# Altium schematic sheet 41-SoC POWER SUPPLY.SchDoc
size 513 x 386 mm
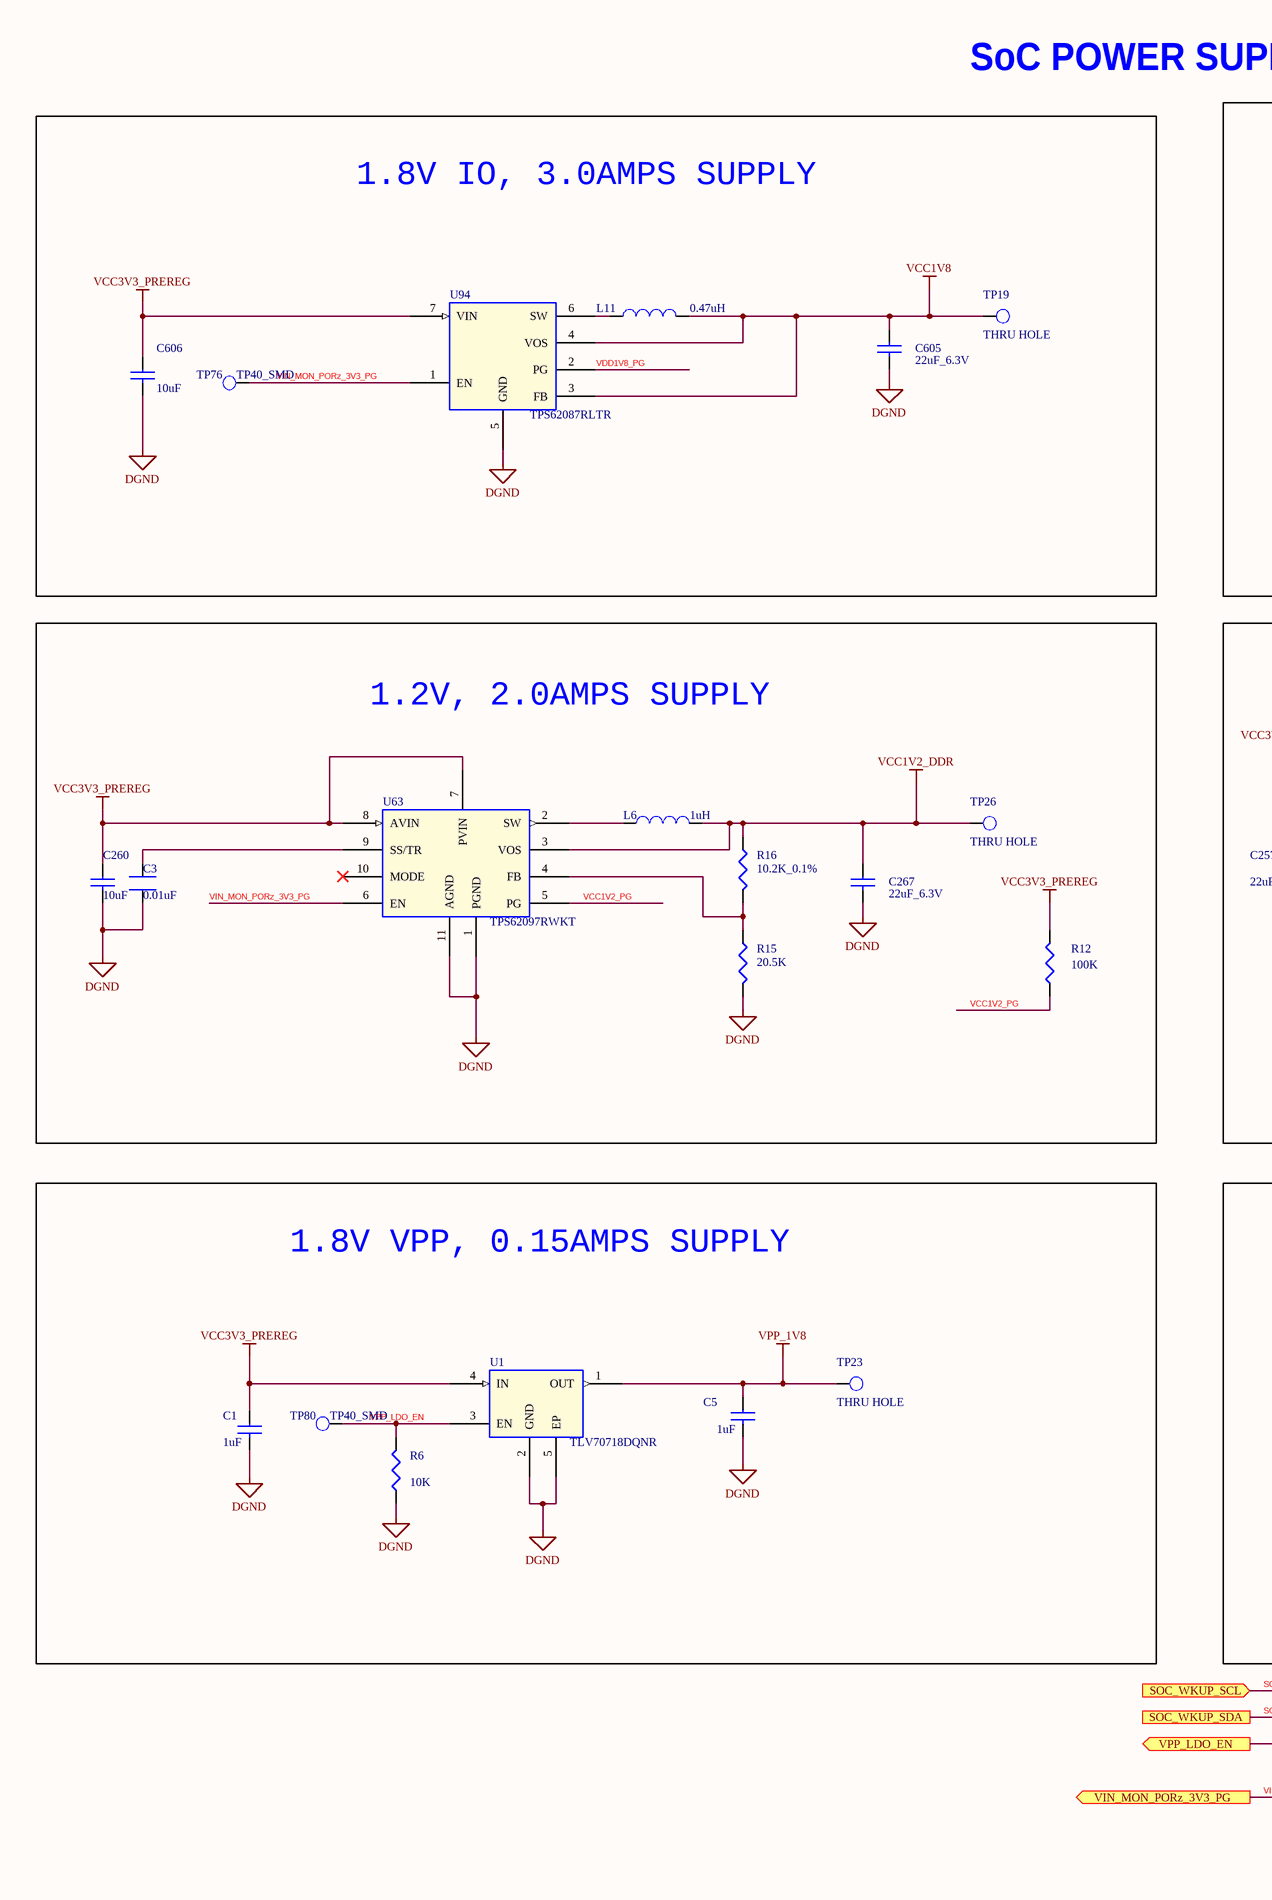
[diagram p0: 41-SoC POWER SUPPLY.SchDoc, left]
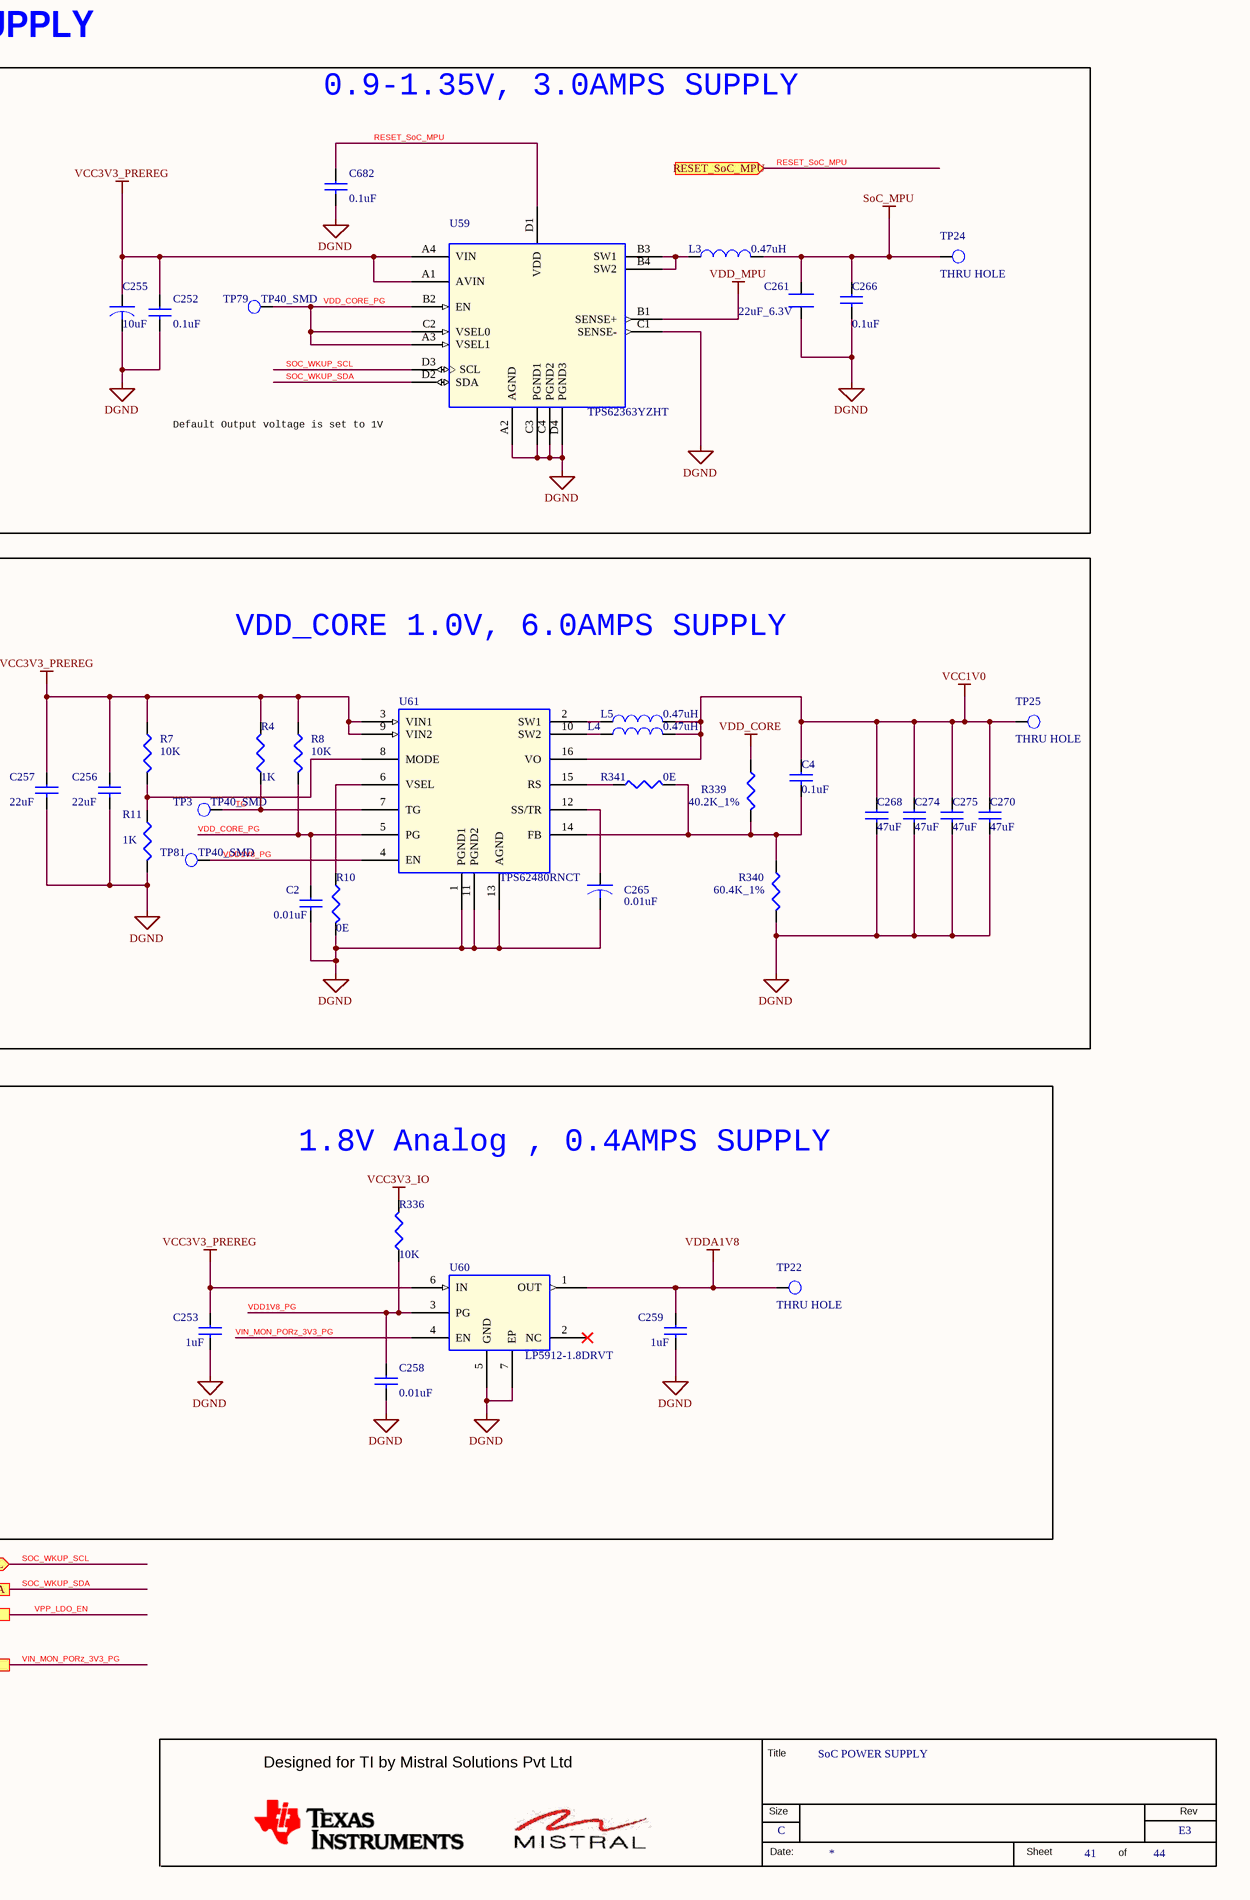
[diagram p1: 41-SoC POWER SUPPLY.SchDoc, right]

## Parts
*  RevCode: E3  Title: SoC POWER SUPPLY  Page Size: C  Page Number: 41  Page Count: 44  (hidden comment: MISTRAL_TITLEBLK_CSIZE)  (graphical)
C1  1uF  [CAP0603_1]
C2  0.01uF  [CAP0201_0-5]
C3  0.01uF  [CAP0201_0-5]
C4  0.1uF  [CAP0201_0-5]
C5  1uF  [CAP0603_1]
C252  0.1uF  [CAP0201_0-5]
C253  1uF  [CAP0603_1]
C255  10uF  [CAP1206_2]
C256  22uF  [CAP1206_2]
C257  22uF  [CAP1206_2]
C258  0.01uF  [CAP0201_0-5]
C259  1uF  [CAP0603_1]
C260  10uF  [CAP0603_1]
C261  22uF_6.3V  [CAP0603]
C265  0.01uF  [CAP0402_0-75]
C266  0.1uF  [CAP0201_0-5]
C267  22uF_6.3V  [CAP0603]
C268  47uF  [CAP0603_1]
C270  47uF  [CAP0603_1]
C274  47uF  [CAP0603_1]
C275  47uF  [CAP0603_1]
C605  22uF_6.3V  [CAP0603]
C606  10uF  [CAP1206_2]
C682  0.1uF  [CAP0201_0-5]
L3  0.47uH  [IND_XEL4030_170X170_SMD_1-6]
L4  0.47uH  [IND_XEL4030_170X170_SMD_1-6]
L5  0.47uH  [IND_XEL4030_170X170_SMD_1-6]
L6  1uH  [IND_IHLP2020AB_210X210_SMD_1-2]
L11  0.47uH  [IND_XEL4030_170X170_SMD_1-6]
R4  1K  [RES0201]
R6  10K  [RES0402_0-5]
R7  10K  [RES0402_0-5]
R8  10K  [RES0402_0-5]
R10  0E  [RES0402_0-5]
R11  1K  [RES0201]
R12  100K  [RES0402_0-5]
R15  20.5K  [RES0402]
R16  10.2K_0.1%  [RES0402]
R336  10K  [RES0402_0-5]
R339  40.2K_1%  [RES0402_0-5]
R340  60.4K_1%  [RES0402_0-5]
R341  0E  [RES0402_0-5]
TP3  TP40_SMD  [TP40_SMD]
TP19  THRU HOLE  [TP_40X65]
TP22  THRU HOLE  [TP_40X65]
TP23  THRU HOLE  [TP_40X65]
TP24  THRU HOLE  [TP_40X65]
TP25  THRU HOLE  [TP_40X65]
TP26  THRU HOLE  [TP_40X65]
TP76  TP40_SMD  [TP40_SMD]
TP79  TP40_SMD  [TP40_SMD]
TP80  TP40_SMD  [TP40_SMD]
TP81  TP40_SMD  [TP40_SMD]
U1  TLV70718DQNR  [X2SON4_TLV71318P_40X40_0-4]
U59  TPS62363YZHT  [DSBGA16_19-68_80X80_0-7]
U60  LP5912-1.8DRVT  [SON6_25-59_85X85_0-8]
U61  TPS62480RNCT  [VQFNHR16_TPS62480_100X120_1]
U63  TPS62097RWKT  [VQFNHR11_TPS62097_80X80_1]
U94  TPS62087RLTR  [VSONHR7_TPS62085_80X80_1]

## Blocks framed on the sheet
1.8V IO, 3.0AMPS SUPPLY: C605 C606 L11 TP19 TP76 U94
0.9-1.35V, 3.0AMPS SUPPLY: C252 C255 C261 C266 C682 L3 TP24 TP79 U59
1.2V, 2.0AMPS SUPPLY: C3 C260 C267 L6 R12 R15 R16 TP26 U63
VDD_CORE 1.0V, 6.0AMPS SUPPLY: C2 C4 C256 C257 C265 C268 C270 C274 C275 L4 L5 R4 R7 R8 R10 R11 R339-R341 TP3 TP25 TP81 U61
1.8V VPP, 0.15AMPS SUPPLY: C1 C5 R6 TP23 TP80 U1
1.8V Analog , 0.4AMPS SUPPLY: C253 C258 C259 R336 TP22 U60

## Ports
RESET_SoC_MPU (in), SOC_WKUP_SCL (in), SOC_WKUP_SDA, VIN_MON_PORz_3V3_PG (out), VPP_LDO_EN (out)

## Nets
DGND: C1.2 C2.2 C3.2 C5.2 C252.2 C253.2 C255.2 C256.2 C257.2 C258.2 C259.2 C260.2 C261.2 C265.2 C266.2 C267.2 C268.2 C270.2 C274.2 C275.2 C605.2 C606.2 C682.2 R6.1 R10.2 R11.2 R15.2 R340.2 U1.2(GND) U1.5(EP) U59.A2(AGND) U59.C1(SENSE-) U59.C3(PGND1) U59.C4(PGND2) U59.D4(PGND3) U60.5(GND) U60.7(EP) U61.1(PGND1) U61.11(PGND2) U61.13(AGND) U63.1(PGND) U63.11(AGND) U94.5(GND)
SoC_MPU: C261.1 C266.1 L3.2 TP24.1(TP)
VCC1V0: C4.1 C268.1 C270.1 C274.1 C275.1 L4.2 L5.2 TP25.1(TP) U61.16(VO)
VCC1V2_DDR: C267.1 L6.2 R16.1 TP26.1(TP) U63.3(VOS)
VCC1V8: C605.1 L11.2 TP19.1(TP) U94.3(FB) U94.4(VOS)
VCC3V3_IO: R336.2
VCC3V3_PREREG: C1.1 C252.1 C253.1 C255.1 C256.1 C257.1 C260.1 C606.1 R4.2 R7.1 R8.1 R12.2 U1.4(IN) U59.A1(AVIN) U59.A4(VIN) U60.6(IN) U61.3(VIN1) U61.9(VIN2) U63.7(PVIN) U63.8(AVIN) U94.7(VIN)
VDD_CORE: R339.1
VDD_MPU: U59.B1(SENSE+)
VDDA1V8: C259.1 TP22.1(TP) U60.1(OUT)
VPP_1V8: C5.1 TP23.1(TP) U1.1(OUT)
RESET_SoC_MPU: C682.1 U59.D1(VDD) ; port RESET_SoC_MPU
SOC_WKUP_SCL: U59.D3(SCL) ; port SOC_WKUP_SCL
SOC_WKUP_SDA: U59.D2(SDA) ; port SOC_WKUP_SDA
TG: R4.1 TP3.1(TP) U61.7(TG)
VCC1V2_PG: R12.1 U63.5(PG)
VDD1V8_PG: C258.1 R336.1 TP81.1(TP) U60.3(PG) U61.4(EN) U94.2(PG)
VDD_CORE_PG: C2.1 R8.2 TP79.1(TP) U59.A3(VSEL1) U59.B2(EN) U59.C2(VSEL0) U61.5(PG)
VIN_MON_PORz_3V3_PG: TP76.1(TP) U60.4(EN) U63.6(EN) U94.1(EN) ; port VIN_MON_PORz_3V3_PG
VPP_LDO_EN: R6.2 TP80.1(TP) U1.3(EN) ; port VPP_LDO_EN
NetC3_1: C3.1 U63.9(SS/TR)
NetC4_2: C4.2 R339.2 R340.1 R341.2 U61.14(FB)
NetC265_1: C265.1 U61.12(SS/TR)
NetL3_1: L3.1 U59.B3(SW1) U59.B4(SW2)
NetL4_1: L4.1 U61.10(SW2)
NetL5_1: L5.1 U61.2(SW1)
NetL6_1: L6.1 U63.2(SW)
NetL11_1: L11.1 U94.6(SW)
NetR7_2: R7.2 R11.1 U61.8(MODE)
NetR10_1: R10.1 U61.6(VSEL)
NetR15_1: R15.1 R16.2 U63.4(FB)
NetR341_1: R341.1 U61.15(RS)

Not connected (* = marked no-connect by the designer): U60 2(NC)*; U63 10(MODE)*

## Notes on the sheet
- SoC POWER SUPPLY
- Default Output voltage is set to 1V
- (in symbol MISTRAL_TITLEBLK_CSIZE) Title; Designed for TI by Mistral Solutions Pvt Ltd; Size; Rev; Date:; Sheet; of

## Library data of the parts
* = MISTRAL_TITLEBLK_CSIZE: Issue: 1.0; Page Create Date: March  8, 1995; Page Modify Date: *
C1 C5 C253 C259 = CAP_Dup5: CAP CERAMIC 1uF 25V 10% X5R 0603; Mistral Part No: 120010080040-R; Mfr_name: AVX CORPORATION; Mfr_part_number: 06033D105KAT2A; Part_type: CAPACITORS\CERAMIC; Project: TI_MAXIE_CPB; Wattage: NA; Customs_HS_Code: 85322990; Custom_Duty: 15%; Library Ref: CAP; MECHANICAL 3D STEP FILE: CAP0603_1; Tolerance: 10%; Voltage: 25V; Package: 0603; Distributor_name: DIGIKEY; Distributor_part_number: 478-5142-1-ND; Height: 0.94MM; Weight: 2mg; Temperature: -55°C+85°C; Datasheet: Y:\MIS_DATABASE\DATASHEETS\CAPACITORS\AVX_MLC.PDF; Crtd /date: MANIRAJA/230118; Chkd/date: MANIRAJA/230118; PCB Footprint: CAP0603_1
C2 = CAP_Dup5: CAP CERAMIC 0.01uF 25V 10% X5R 0201; Mistral Part No: 120018010007-R; Mfr_name: MURATA; Mfr_part_number: GRM033R61E103KA12J; Part_type: CAPACITORS\CERAMIC; Wattage: NA; Project: TI_MAXIE_CPB; Customs_HS_Code: 85322990; Custom_Duty: 15%; NI_MARK: DNI; MECHANICAL 3D STEP FILE: CAP0201_0-5; Temperature: -55°C+85°C; Weight: 0.33mg; Tolerance: 10%; Voltage: 25V; Package: 0201; Distributor_name: DIGIKEY; Distributor_part_number: GRM033R61E103KA12J-ND; Height: 0.33MM; Datasheet: Y:\MIS_DATABASE\DATASHEETS\CAPACITORS\GRM033R61E103KA12.PDF; Crtd /date: MANIRAJA/230118; Chkd/date: MANIRAJA/230118; PCB Footprint: CAP0201_0-5; Library Ref: CAP
C3 = CAP_Dup3: CAP CERAMIC 0.01uF 25V 10% X5R 0201; Part_type: CAPACITORS\CERAMIC; Mfr_part_number: GRM033R61E103KA12J; Mfr_name: MURATA; Mistral Part No: 120018010007-R; Custom_Duty: 15%; Customs_HS_Code: 85322990; Project: TI_MAXIE_CPB; Wattage: NA; Chkd/date: MANIRAJA/230118; Crtd /date: MANIRAJA/230118; Datasheet: Y:\MIS_DATABASE\DATASHEETS\CAPACITORS\GRM033R61E103KA12.PDF; Height: 0.33MM; Distributor_part_number: GRM033R61E103KA12J-ND; Distributor_name: DIGIKEY; Package: 0201; Voltage: 25V; Tolerance: 10%; Weight: 0.33mg; Temperature: -55°C+85°C; MECHANICAL 3D STEP FILE: CAP0201_0-5; PCB Footprint: CAP0201_0-5; Library Ref: CAP
C4 = CAP_Dup5: CAP CERAMIC 0.1uF 16V 10% X5R 0201; Part_type: CAPACITORS\CERAMIC; Mfr_part_number: GRM033R61C104KE84J; Mfr_name: MURATA; Mistral Part No: 120009030072-R; Custom_Duty: 15%; Customs_HS_Code: 85322990; Wattage: NA; Project: TI_MAXIE_CPB; NI_MARK: DNI; MECHANICAL 3D STEP FILE: CAP0201_0-5; Chkd/date: MANIRAJA/120218; Crtd /date: MANIRAJA/120218; Datasheet: Y:\MIS_DATABASE\DATASHEETS\CAPACITORS\GRM033R61C104KE84.PDF; Temperature: -55°C+85°C; Weight: 0.33mg; Height: 0.33MM; Distributor_part_number: 490-16742-1-ND; Distributor_name: DIGIKEY; Package: 0201; Voltage: 16V; Tolerance: 10%; PCB Footprint: CAP0201_0-5; Library Ref: CAP
C252 C682 = CAP_Dup5: CAP CERAMIC 0.1uF 16V 10% X5R 0201; Part_type: CAPACITORS\CERAMIC; Mfr_part_number: GRM033R61C104KE84J; Mfr_name: MURATA; Mistral Part No: 120009030072-R; Custom_Duty: 15%; Customs_HS_Code: 85322990; Wattage: NA; Project: TI_MAXIE_CPB; PCB Footprint: CAP0201_0-5; MECHANICAL 3D STEP FILE: CAP0201_0-5; Chkd/date: MANIRAJA/120218; Crtd /date: MANIRAJA/120218; Datasheet: Y:\MIS_DATABASE\DATASHEETS\CAPACITORS\GRM033R61C104KE84.PDF; Temperature: -55°C+85°C; Weight: 0.33mg; Height: 0.33MM; Distributor_part_number: 490-16742-1-ND; Distributor_name: DIGIKEY; Package: 0201; Voltage: 16V; Tolerance: 10%; Library Ref: CAP
C255 = CAP: CAP CERAMIC 10uF 50V 20% X5R 1206; Part_type: CAPACITORS\CERAMIC; Mfr_part_number: GRM31CR61H106MA12L; Mfr_name: MURATA; Mistral Part No: 120018010013-R; Custom_Duty: 15%; Customs_HS_Code: 85322990; Wattage: NA; Project: TI_MAXIE_CPB; Chkd/date: MANIRAJA/240118; Crtd /date: MANIRAJA/240118; Datasheet: Y:\MIS_DATABASE\DATASHEETS\CAPACITORS\GRM31CR61H106MA12.PDF; Temperature: -55°C+85°C; Weight: 40mg; Height: 1.80MM; Distributor_part_number: 490-10756-1-ND; Distributor_name: DIGIKEY; Package: 1206; Voltage: 50V; Tolerance: 20%; PCB Footprint: CAP1206_2; MECHANICAL 3D STEP FILE: CAP1206_2; Library Ref: CAP; Footprint Ref: CAP1206_2; Library Path: Y:\MIS_DATABASE\Library\ALTIUM_TOOL\SCHEMATICS_PARTS\MS_DISCRETE_Library.schlib; Footprint Path: Y:\MIS_DATABASE\Library\ALTIUM_TOOL\PCB_FOOTPRINTS\Altium_Footprint_Lib.PcbLib
C256 C257 = CAP_Dup5: CAP CERAMIC 22uF 16V 20% X7R 1206; Mistral Part No: 120017010003-R; Mfr_name: TAIYO YUDEN; Mfr_part_number: EMK316BB7226ML-T; Part_type: CAPACITORS\CERAMIC; Project: TRMM_SMART-M_PS; Wattage: NA; Customs_HS_Code: 85322990; Custom_Duty: 15%; PCB Footprint: CAP1206_2; Tolerance: 20%; Voltage: 16V; Package: 1206; Distributor_name: DIGIKEY; Distributor_part_number: 587-4319-1-ND; Height: 1.90MM; Weight: 16.2mg; Temperature: -55°C+125°C; Datasheet: Y:\MIS_DATABASE\DATASHEETS\CAPACITORS\EMK316BB7226ML.PDF; Crtd /date: VASANTHA/170117; Chkd/date: VASANTHA/170117; MECHANICAL 3D STEP FILE: CAP1206_2; Library Ref: CAP
C258 = CAP_Dup5: CAP CERAMIC 0.01uF 25V 10% X5R 0201; Part_type: CAPACITORS\CERAMIC; Mfr_part_number: GRM033R61E103KA12J; Mfr_name: MURATA; Mistral Part No: 120018010007-R; Custom_Duty: 15%; Customs_HS_Code: 85322990; Project: TI_MAXIE_CPB; Wattage: NA; Chkd/date: MANIRAJA/230118; Crtd /date: MANIRAJA/230118; Datasheet: Y:\MIS_DATABASE\DATASHEETS\CAPACITORS\GRM033R61E103KA12.PDF; Height: 0.33MM; Distributor_part_number: GRM033R61E103KA12J-ND; Distributor_name: DIGIKEY; Package: 0201; Voltage: 25V; Tolerance: 10%; Weight: 0.33mg; Temperature: -55°C+85°C; MECHANICAL 3D STEP FILE: CAP0201_0-5; PCB Footprint: CAP0201_0-5; Library Ref: CAP
C260 = CAP_Dup5: CAP CERAMIC 10uF 10V 10% X5R 0603; Mistral Part No: 120010080001-R; Mfr_name: AVX CORPORATION; Mfr_part_number: 0603ZD106KAT2A; Part_type: CAPACITORS\CERAMIC; Project: TI_MAXIE_CPB; Wattage: NA; Customs_HS_Code: 85322990; Custom_Duty: 15%; PCB Footprint: CAP0603_1; Tolerance: 10%; Voltage: 10V; Package: 0603; Distributor_name: DIGIKEY; Distributor_part_number: 478-10766-1-ND; Height: 0.94MM; Weight: 2mg; Temperature: -55°C+85°C; Datasheet: Y:\MIS_DATABASE\DATASHEETS\CAPACITORS\AVX_MLC.PDF; Crtd /date: MANIRAJA/230118; Chkd/date: MANIRAJA/230118; MECHANICAL 3D STEP FILE: CAP0603_1; Library Ref: CAP
C261 = CAP_Dup3: CAP CERAMIC 22uF 6.3V 20% X5R 0603; Mistral Part No: 120015090007-R; Mfr_name: MURATA; Mfr_part_number: GRM188R60J226MEA0; Part_type: CAPACITORS\CERAMIC; Alternate_mfr_name_A: YAGEO AMERICA; Alternate_mfr_part_number_A: CC0603MRX5R5BB226; Project: OCTBTS_3000; Wattage: NA; Customs_HS_Code: 85322990; Custom_Duty: 15%; PCB Footprint: CAP0603; Tolerance: 20%; Voltage: 6.3V; Package: 0603; Distributor_name: DIGIKEY; Distributor_part_number: 490-7611-2-ND; Height: 1.00MM; Weight: NA; Temperature: -55°C+85°C; Datasheet: Y:\MIS_DATABASE\DATASHEETS\CAPACITORS\GRM188SERIES.PDF; Crtd /date: JEBRAN/090915; Chkd/date: JEBRAN/090915; Library Ref: CAP; Distributor_name_A: DIGIKEY; Distributor_part_number_A: 311-1815-1-ND
C265 = CAP: CAP CERAMIC 0.01uF 10V 10% X7R 0402; Mistral Part No: 120009030017-R; Mfr_name: AVX CORPORATION; Mfr_part_number: 0402ZC103KAT2A; Part_type: CAPACITORS\CERAMIC; Project: ADR; Wattage: NA; Customs_HS_Code: 85322990; Custom_Duty: 15%; Tolerance: 10%; Voltage: 10V; Package: 0402; Distributor_name: DIGIKEY; Distributor_part_number: 478-7890-1-ND; Library Ref: CAP; Height: 0.56MM; Weight: 0.65mg; Temperature: -55°C+125°C; Datasheet: Y:\MIS_DATABASE\DATASHEETS\CAPACITORS\AVX_MLC.PDF; Crtd /date: MAZHAR/201005; Chkd/date: VASANTHA/061216; MECHANICAL 3D STEP FILE: CAP0402_0-75; PCB Footprint: CAP0402_0-75
C266 = CAP_Dup5: CAP CERAMIC 0.1uF 16V 10% X5R 0201; Mistral Part No: 120009030072-R; Mfr_name: MURATA; Mfr_part_number: GRM033R61C104KE84J; Part_type: CAPACITORS\CERAMIC; Project: TI_MAXIE_CPB; Wattage: NA; Customs_HS_Code: 85322990; Custom_Duty: 15%; PCB Footprint: CAP0201_0-5; Tolerance: 10%; Voltage: 16V; Package: 0201; Distributor_name: DIGIKEY; Distributor_part_number: 490-16742-1-ND; Height: 0.33MM; Weight: 0.33mg; Temperature: -55°C+85°C; Datasheet: Y:\MIS_DATABASE\DATASHEETS\CAPACITORS\GRM033R61C104KE84.PDF; Crtd /date: MANIRAJA/120218; Chkd/date: MANIRAJA/120218; MECHANICAL 3D STEP FILE: CAP0201_0-5; Library Ref: CAP
C267 = CAP_Dup5: CAP CERAMIC 22uF 6.3V 20% X5R 0603; Part_type: CAPACITORS\CERAMIC; Mfr_part_number: GRM188R60J226MEA0; Mfr_name: MURATA; Mistral Part No: 120015090007-R; Alternate_mfr_name_A: YAGEO AMERICA; Alternate_mfr_part_number_A: CC0603MRX5R5BB226; Custom_Duty: 15%; Customs_HS_Code: 85322990; Wattage: NA; Project: OCTBTS_3000; Chkd/date: JEBRAN/090915; Crtd /date: JEBRAN/090915; Datasheet: Y:\MIS_DATABASE\DATASHEETS\CAPACITORS\GRM188SERIES.PDF; Temperature: -55°C+85°C; Weight: NA; Height: 1.00MM; Distributor_part_number: 490-7611-2-ND; Distributor_name: DIGIKEY; Package: 0603; Voltage: 6.3V; Tolerance: 20%; Library Ref: CAP; Distributor_name_A: DIGIKEY; Distributor_part_number_A: 311-1815-1-ND; PCB Footprint: CAP0603
C268 = CAP_Dup5: CAP CERAMIC 47uF 6.3V 20% X5R 0603; Part_type: CAPACITORS\CERAMIC; Mfr_part_number: GRM188R60J476ME15D; Mfr_name: MURATA; Mistral Part No: 120016110001-R; Custom_Duty: 15%; Customs_HS_Code: 85322990; Wattage: NA; Project: DLRL_3U_ESM_VPX; MECHANICAL 3D STEP FILE: CAP0603_1; Chkd/date: VASANTHA/211116; Crtd /date: MANIRAJA/211116; Datasheet: Y:\MIS_DATABASE\DATASHEETS\CAPACITORS\GRM188SERIES.PDF; Temperature: -55°C+85°C; Weight: 9.10mg; Height: 0.90MM; Distributor_part_number: 490-13247-1-ND; Distributor_name: DIGIKEY; Package: 0603; Voltage: 6.3V; Tolerance: 20%; PCB Footprint: CAP0603_1; Library Ref: CAP
C270 C274 C275 = CAP_Dup5: CAP CERAMIC 47uF 6.3V 20% X5R 0603; Mistral Part No: 120016110001-R; Mfr_name: MURATA; Mfr_part_number: GRM188R60J476ME15D; Part_type: CAPACITORS\CERAMIC; Project: DLRL_3U_ESM_VPX; Wattage: NA; Customs_HS_Code: 85322990; Custom_Duty: 15%; Tolerance: 20%; Voltage: 6.3V; Package: 0603; Distributor_name: DIGIKEY; Distributor_part_number: 490-13247-1-ND; Height: 0.90MM; Weight: 9.10mg; Temperature: -55°C+85°C; Datasheet: Y:\MIS_DATABASE\DATASHEETS\CAPACITORS\GRM188SERIES.PDF; Crtd /date: MANIRAJA/211116; Chkd/date: VASANTHA/211116; MECHANICAL 3D STEP FILE: CAP0603_1; PCB Footprint: CAP0603_1; Library Ref: CAP
C605 = CAP_Dup5: CAP CERAMIC 22uF 6.3V 20% X5R 0603; Mistral Part No: 120015090007-R; Mfr_name: MURATA; Mfr_part_number: GRM188R60J226MEA0; Part_type: CAPACITORS\CERAMIC; Alternate_mfr_name_A: YAGEO AMERICA; Alternate_mfr_part_number_A: CC0603MRX5R5BB226; Project: OCTBTS_3000; Wattage: NA; Customs_HS_Code: 85322990; Custom_Duty: 15%; Tolerance: 20%; Voltage: 6.3V; Package: 0603; Distributor_name: DIGIKEY; Distributor_part_number: 490-7611-2-ND; Height: 1.00MM; Weight: NA; Temperature: -55°C+85°C; Datasheet: Y:\MIS_DATABASE\DATASHEETS\CAPACITORS\GRM188SERIES.PDF; Crtd /date: JEBRAN/090915; Chkd/date: JEBRAN/090915; Library Ref: CAP; Distributor_name_A: DIGIKEY; Distributor_part_number_A: 311-1815-1-ND; PCB Footprint: CAP0603
C606 = CAP_Dup5: CAP CERAMIC 10uF 16V 10% X7R 1206; Mistral Part No: 120009090010-R; Mfr_name: KEMET; Mfr_part_number: C1206C106K4RACTU; Part_type: CAPACITORS\CERAMIC; Project: ADE POWER SUPPLY; Wattage: NA; Customs_HS_Code: 85322990; Custom_Duty: 15%; PCB Footprint: CAP1206_2; Tolerance: 10%; Voltage: 16V; Package: 1206; Distributor_name: DIGIKEY; Distributor_part_number: 399-3525-1-ND; Height: 1.80MM; Weight: 16.2mg; Temperature: -55°C+125°C; Datasheet: Y:\MIS_DATABASE\DATASHEETS\CAPACITORS\KEMET-C08_X.PDF; Crtd /date: MAZHAR/120909; Chkd/date: VASANTHA/291216; MECHANICAL 3D STEP FILE: CAP1206_2; Library Ref: CAP
L3 = INDUCTOR: IND POWER 0.47uH 20% 11.2A SMD; Mistral Part No: 130018020040-R; Mfr_name: COILCARFT; Mfr_part_number: XFL4015-471MEB; Project: TI_MAXIE_CPB; Voltage: NA; Customs_HS_Code: 85437099; Custom_Duty: 24%; Part_type: INDUCTOR; Tolerance: 20%; Wattage: NA; Package: SMD; Distributor_name: MOUSER; Distributor_part_number: 994-XFL4015-471MEB; Height: 1.60MM; Weight: 95mg; Temperature: -40°C+125°C; Datasheet: Y:\MIS_DATABASE\DATASHEETS\DISCRETES\INDUCTORS\XFL4015.PDF; Crtd /date: ALVY/150218; Chkd/date: MANIRAJA/150218; MECHANICAL 3D STEP FILE: IND_XEL4030_170X170_SMD_1-6; PCB Footprint: IND_XEL4030_170X170_SMD_1-6; Library Path: Y:\MIS_DATABASE\Library\ALTIUM_TOOL\SCHEMATICS_PARTS\MS_DISCRETE_Library.schlib; Footprint Path: Y:\MIS_DATABASE\Library\ALTIUM_TOOL\PCB_FOOTPRINTS\Altium_Footprint_Lib.PcbLib; Library Ref: INDUCTOR; Footprint Ref: IND_XEL4030_170X170_SMD_1-6
L4 L5 L11 = INDUCTOR: IND POWER 0.47uH 20% 11.2A SMD; Mfr_part_number: XFL4015-471MEB; Mfr_name: COILCARFT; Mistral Part No: 130018020040-R; Custom_Duty: 24%; Customs_HS_Code: 85437099; Wattage: NA; Project: TI_MAXIE_CPB; MECHANICAL 3D STEP FILE: IND_XEL4030_170X170_SMD_1-6; Chkd/date: MANIRAJA/150218; Crtd /date: ALVY/150218; Datasheet: Y:\MIS_DATABASE\DATASHEETS\DISCRETES\INDUCTORS\XFL4015.PDF; Temperature: -40°C+125°C; Weight: 95mg; Height: 1.60MM; Distributor_part_number: 994-XFL4015-471MEB; Distributor_name: MOUSER; Package: SMD; Voltage: NA; Tolerance: 20%; Part_type: INDUCTOR; PCB Footprint: IND_XEL4030_170X170_SMD_1-6; Library Path: Y:\MIS_DATABASE\Library\ALTIUM_TOOL\SCHEMATICS_PARTS\MS_DISCRETE_Library.schlib; Footprint Path: Y:\MIS_DATABASE\Library\ALTIUM_TOOL\PCB_FOOTPRINTS\Altium_Footprint_Lib.PcbLib; Library Ref: INDUCTOR; Footprint Ref: IND_XEL4030_170X170_SMD_1-6
L6 = INDUCTOR: IND POWER 1uH 4.4A 20% SMD; Mfr_part_number: IHLP2020ABER1R0M01; Mfr_name: VISHAY; Mistral Part No: 130017030015-R; Custom_Duty: 24%; Customs_HS_Code: 85437099; Wattage: NA; Project: ADA_3U_FMC; MECHANICAL 3D STEP FILE: IND_IHLP2020AB_210X210_SMD_1-2; Chkd/date: VASANTHA/170317; Crtd /date: MANIRAJA/160317; Datasheet: Y:\MIS_DATABASE\DATASHEETS\DISCRETES\INDUCTORS\IHLP2020AB.PDF; Temperature: -55°C+125°C; Weight: 200mg; Height: 1.20MM; Distributor_part_number: 541-1704-1-ND; Distributor_name: DIGIKEY; Package: SMD; Voltage: NA; Tolerance: 20%; Part_type: INDUCTOR; PCB Footprint: IND_IHLP2020AB_210X210_SMD_1-2; Library Ref: INDUCTOR
R4 = RESISTOR_Dup4: RES 1K 1/20W 5% 0201; Mistral Part No: 110015080014-R; Mfr_name: VISHAY; Mfr_part_number: CRCW02011K00FKED; Part_type: RESISTORS\FIXED; Project: OCTASIC_3000; Voltage: NA; Customs_HS_Code: 85332119; Custom_Duty: 15%; NI_MARK: DNI; PCB Footprint: RES0201; Tolerance: 5%; Wattage: 1/20W; Package: 0201; Distributor_name: DIGIKEY; Distributor_part_number: 541-1.00KAABCT-ND; Height: 0.28MM; Weight: NA; Temperature: -55°C+155°C; Datasheet: Y:\MIS_DATABASE\DATASHEETS\RESISTORS\CRCW0201.PDF; Crtd /date: JEBRAN/110815; Chkd/date: JEBRAN/110815; Library Ref: RESISTOR
R6 R7 = RESISTOR_Dup5: RES 10K 1/16W 5% 0402; Part_type: RESISTORS\FIXED; Mfr_part_number: RC0402JR-0710KL; Mfr_name: YAGEO AMERICA; Mistral Part No: 110009030208-R; Custom_Duty: 15%; Customs_HS_Code: 85332119; Voltage: NA; Project: HSE; PCB Footprint: RES0402_0-5; MECHANICAL 3D STEP FILE: RES0402_0-5; RoHS: Pb-Free; Chkd/date: VASANTHA/061216; Crtd /date: MAZHAR/230805; Datasheet: Y:\MIS_DATABASE\DATASHEETS\RESISTORS\YAGEO-RC0402.PDF; Temperature: -55°C+155°C; Weight: 0.65mg; Height: 0.40MM; Distributor_part_number: 311-10KJRCT-ND; Distributor_name: DIGIKEY; Package: 0402; Wattage: 1/16W; Tolerance: 5%; Library Ref: RESISTOR; Footprint Ref: RES0402_0-5; Library Path: Y:\MIS_DATABASE\Library\ALTIUM_TOOL\SCHEMATICS_PARTS\MS_DISCRETE_Library.schlib; Footprint Path: Y:\MIS_DATABASE\Library\ALTIUM_TOOL\PCB_FOOTPRINTS\Altium_Footprint_Lib.PcbLib
R8 R336 = RESISTOR_Dup5: RES 10K 1/16W 5% 0402; Mistral Part No: 110009030208-R; Mfr_name: YAGEO AMERICA; Mfr_part_number: RC0402JR-0710KL; Part_type: RESISTORS\FIXED; Project: HSE; Voltage: NA; Customs_HS_Code: 85332119; Custom_Duty: 15%; Tolerance: 5%; Wattage: 1/16W; Package: 0402; Distributor_name: DIGIKEY; Distributor_part_number: 311-10KJRCT-ND; Height: 0.40MM; Weight: 0.65mg; Temperature: -55°C+155°C; Datasheet: Y:\MIS_DATABASE\DATASHEETS\RESISTORS\YAGEO-RC0402.PDF; Crtd /date: MAZHAR/230805; Chkd/date: VASANTHA/061216; RoHS: Pb-Free; MECHANICAL 3D STEP FILE: RES0402_0-5; PCB Footprint: RES0402_0-5; Library Ref: RESISTOR; Footprint Ref: RES0402_0-5; Library Path: Y:\MIS_DATABASE\Library\ALTIUM_TOOL\SCHEMATICS_PARTS\MS_DISCRETE_Library.schlib; Footprint Path: Y:\MIS_DATABASE\Library\ALTIUM_TOOL\PCB_FOOTPRINTS\Altium_Footprint_Lib.PcbLib
R10 = RESISTOR_Dup5: RES 0E 1/16W 0402; Part_type: RESISTORS\FIXED; Mfr_part_number: CRCW04020000Z0ED; Mfr_name: VISHAY; Mistral Part No: 110010080019-P; Custom_Duty: 15%; Customs_HS_Code: 85332119; Voltage: NA; Project: PB_BUGBASE; MECHANICAL 3D STEP FILE: RES0402_0-5; RoHS: Pb-Free; Chkd/date: VASANTHA/201216; Crtd /date: MUDDU/190810; Datasheet: Y:\MIS_DATABASE\DATASHEETS\RESISTORS\CRCW0603.PDF; Temperature: -55°C+155°C; Weight: 0.65g/1000pcs; Height: 0.40MM; Distributor_part_number: 541-0.0JCT-ND; Distributor_name: DIGIKEY; Package: 0402; Wattage: 1/16W; Tolerance: NA; PCB Footprint: RES0402_0-5; Library Ref: RESISTOR; Footprint Ref: RES0402_0-5; Library Path: Y:\MIS_DATABASE\Library\ALTIUM_TOOL\SCHEMATICS_PARTS\MS_DISCRETE_Library.schlib; Footprint Path: Y:\MIS_DATABASE\Library\ALTIUM_TOOL\PCB_FOOTPRINTS\Altium_Footprint_Lib.PcbLib
R11 = RESISTOR_Dup5: RES 1K 1/20W 5% 0201; Mistral Part No: 110015080014-R; Mfr_name: VISHAY; Mfr_part_number: CRCW02011K00FKED; Part_type: RESISTORS\FIXED; Project: OCTASIC_3000; Voltage: NA; Customs_HS_Code: 85332119; Custom_Duty: 15%; NI_MARK: DNI; Tolerance: 5%; Wattage: 1/20W; Package: 0201; Distributor_name: DIGIKEY; Distributor_part_number: 541-1.00KAABCT-ND; Height: 0.28MM; Weight: NA; Temperature: -55°C+155°C; Datasheet: Y:\MIS_DATABASE\DATASHEETS\RESISTORS\CRCW0201.PDF; Crtd /date: JEBRAN/110815; Chkd/date: JEBRAN/110815; PCB Footprint: RES0201; Library Ref: RESISTOR
R12 = RESISTOR_Dup5: RES 100K 1/16W 5% 0402; Part_type: RESISTORS\FIXED; Mfr_part_number: CRCW0402100KJNED; Mfr_name: VISHAY; Mistral Part No: 110011060002-R; Custom_Duty: 15%; Customs_HS_Code: 85332119; Voltage: NA; Project: AM4515_EVM_LCD; MECHANICAL 3D STEP FILE: RES0402_0-5; Chkd/date: VASANTHA/061216; Crtd /date: BAVISH/010611; Datasheet: Y:\MIS_DATABASE\DATASHEETS\RESISTORS\CRCW0603.PDF; Temperature: -55°C+155°C; Weight: 0.65mg; Height: 0.40MM; Distributor_part_number: 541-100KJCT-ND; Distributor_name: DIGIKEY; Package: 0402; Wattage: 1/16W; Tolerance: 5%; PCB Footprint: RES0402_0-5; Library Ref: RESISTOR
R15 = RESISTOR_Dup5: RES 20.5K 1/10W 1% 0402; Mistral Part No: 110010090063-R; Mfr_name: PANASONIC-ECG; Mfr_part_number: ERJ-2RKF2052X; Part_type: RESISTORS\FIXED; Project: ITS; Customs_HS_Code: 85332119; Custom_Duty: 15%; Tolerance: 1%; Wattage: 1/10W; Package: 0402; Distributor_name: DIGIKEY; Distributor_part_number: P20.5KLCT-ND; Height: 0.40MM; Weight: 0.8/1000g; Temperature: -55°C+125°C; Datasheet: Y:\MIS_DATABASE\DATASHEETS\RESISTORS\ERJ2R.PDF; Crtd /date: BAVISH/290910; Chkd/date: MAZHAR/0141010; PCB Footprint: RES0402; Library Ref: RESISTOR; Footprint Ref: RES0402; Library Path: Y:\MIS_DATABASE\Library\ALTIUM_TOOL\SCHEMATICS_PARTS\MS_DISCRETE_Library.schlib; Footprint Path: Y:\MIS_DATABASE\Library\ALTIUM_TOOL\PCB_FOOTPRINTS\Altium_Footprint_Lib.PcbLib
R16 = RESISTOR_Dup5: RES 10.2K 1/16W 0.1% 0402; Mistral Part No: 110011050017-R; Mfr_name: VISHAY; Mfr_part_number: TNPW040210K2BEED; Part_type: RESISTORS\FIXED; Project: HMC; Voltage: NA; Customs_HS_Code: 85332119; Custom_Duty: 15%; Tolerance: 0.1%; Wattage: 1/16W; Package: 0402; Distributor_name: DIGIKEY; Distributor_part_number: TNP10.2KDACT-ND; Height: 0.40MM; Weight: 0.65/1000g; Temperature: -55°C+125°C; Datasheet: Y:\MIS_DATABASE\DATASHEETS\RESISTORS\VISHAY_TNPW.PDF; Crtd /date: BAVISH/240511; Chkd/date: MAZHAR/200611; PCB Footprint: RES0402; Library Ref: RESISTOR
R339 = RESISTOR_Dup5: RES 40.2K 1/16W 1% 0402; Mistral Part No: 110009030811; Mfr_name: YAGEO AMERICA; Mfr_part_number: RC0402FR-0740K2L; Part_type: RESISTORS\FIXED; Project: G4SLIM; Voltage: NA; Customs_HS_Code: 85332119; Custom_Duty: 15%; Tolerance: 1%; Wattage: 1/16W; Package: 0402; Distributor_name: DIGIKEY; Distributor_part_number: 311-40.2KLRDKR-ND; Height: 0.40MM; Weight: 0.65mg; Temperature: -55°C+155°C; Datasheet: Y:\MIS_DATABASE\DATASHEETS\RESISTORS\YAGEO_RES.PDF; Crtd /date: MAZHAR/170505; Chkd/date: VASANTHA/291216; MECHANICAL 3D STEP FILE: RES0402_0-5; Library Ref: RESISTOR; Footprint Ref: RES0402_0-5; Library Path: Y:\MIS_DATABASE\Library\ALTIUM_TOOL\SCHEMATICS_PARTS\MS_DISCRETE_Library.schlib; Footprint Path: Y:\MIS_DATABASE\Library\ALTIUM_TOOL\PCB_FOOTPRINTS\Altium_Footprint_Lib.PcbLib; PCB Footprint: RES0402_0-5
R340 = RESISTOR_Dup5: RES 60.4K 1/16W 1% 0402; Mistral Part No: 110012110012-R; Mfr_name: YAGEO AMERICA; Mfr_part_number: RC0402FR-0760K4L; Part_type: RESISTORS\FIXED; Cust_part_number: 4700-80042E; Project: ITS-CONTROLER_CARD; Voltage: NA; Customs_HS_Code: 85332119; Custom_Duty: 15%; Tolerance: 1%; Wattage: 1/16W; Package: 0402; Distributor_name: DIGIKEY; Distributor_part_number: 311-60.4KLRCT-ND; Height: 0.40MM; Weight: 0.65mg; Temperature: -55°C+155°C; Datasheet: Y:\MIS_DATABASE\DATASHEETS\RESISTORS\YAGEO-RC0402.PDF; Crtd /date: USMAN/201112; Chkd/date: VASANTHA/281216; MECHANICAL 3D STEP FILE: RES0402_0-5; PCB Footprint: RES0402_0-5; Library Ref: RESISTOR
R341 = RESISTOR_Dup5: RES 0E 1/16W 0402; Mistral Part No: 110010080019-P; Mfr_name: VISHAY; Mfr_part_number: CRCW04020000Z0ED; Part_type: RESISTORS\FIXED; Project: PB_BUGBASE; Tolerance: NA; Customs_HS_Code: 85332119; Custom_Duty: 15%; NI_MARK: DNI; Voltage: NA; Wattage: 1/16W; Package: 0402; Distributor_name: DIGIKEY; Distributor_part_number: 541-0.0JCT-ND; Height: 0.40MM; Weight: 0.65g/1000pcs; Temperature: -55°C+155°C; Datasheet: Y:\MIS_DATABASE\DATASHEETS\RESISTORS\CRCW0603.PDF; Crtd /date: MUDDU/190810; Chkd/date: VASANTHA/201216; RoHS: Pb-Free; MECHANICAL 3D STEP FILE: RES0402_0-5; PCB Footprint: RES0402_0-5; Library Ref: RESISTOR; Footprint Ref: RES0402_0-5; Library Path: Y:\MIS_DATABASE\Library\ALTIUM_TOOL\SCHEMATICS_PARTS\MS_DISCRETE_Library.schlib; Footprint Path: Y:\MIS_DATABASE\Library\ALTIUM_TOOL\PCB_FOOTPRINTS\Altium_Footprint_Lib.PcbLib
TP3 TP76 TP80 TP81 = TESTPOINT: TESTPOINT CIR 40 SMD; Mfr_name: LOCAL; Mistral Part No: 130009030933; MECHANICAL 3D STEP FILE: NA; Project: RAINIER-3; NI_MARK: DNI; PCB Footprint: TP40_SMD; Footprint Path: Y:\MIS_DATABASE\Library\ALTIUM_TOOL\PCB_FOOTPRINTS\Altium_Footprint_Lib.PcbLib; Library Path: Y:\MIS_DATABASE\Library\ALTIUM_TOOL\SCHEMATICS_PARTS\MS_DISCRETE_Library.schlib; Datasheet: NA; Temperature: NA; Weight: NA; Wattage: NA; Voltage: NA; Tolerance: NA; Chkd/date: MAZHAR/190505; Crtd /date: MAZHAR/190505; Height: NA; Distributor_part_number: NA; Distributor_name: NA; Package: SMD; Part_type: TESTPOINT; Mfr_part_number: TP40_SMD; Library Ref: TESTPOINT; Footprint Ref: TP40_SMD; RoHS: NA
TP19 TP22-TP26 = TESTPOINT: TESTPOINT 1.0MM DRILL PTH; Mistral Part No: 130009030938; Mfr_name: LOCAL; Part_type: MISC\TESTPOINT; Project: HSE; NI_MARK: DNI; PCB Footprint: TP_40X65; Mfr_part_number: TP_40X65; Package: THRU-HOLE; Distributor_name: NA; Distributor_part_number: NA; Height: NA; Datasheet: NA; Crtd /date: SHREESHAIL/041005; Chkd/date: MAZHAR/271211; Library Ref: TESTPOINT
TP79 = TESTPOINT: TESTPOINT CIR 40 SMD; Mistral Part No: 130009030933; Mfr_name: LOCAL; Project: RAINIER-3; Tolerance: NA; NI_MARK: DNI; PCB Footprint: TP40_SMD; Mfr_part_number: TP40_SMD; Part_type: TESTPOINT; Package: SMD; Distributor_name: NA; Distributor_part_number: NA; Height: NA; Crtd /date: MAZHAR/190505; Chkd/date: MAZHAR/190505; Voltage: NA; Wattage: NA; Weight: NA; Temperature: NA; Datasheet: NA; MECHANICAL 3D STEP FILE: NA; Library Path: Y:\MIS_DATABASE\Library\ALTIUM_TOOL\SCHEMATICS_PARTS\MS_DISCRETE_Library.schlib; Footprint Path: Y:\MIS_DATABASE\Library\ALTIUM_TOOL\PCB_FOOTPRINTS\Altium_Footprint_Lib.PcbLib; Library Ref: TESTPOINT; Footprint Ref: TP40_SMD; RoHS: NA
U1 = TLV71318PDQNR_X2SON4: IC 200mA LOW IQ LOW NOISE LDO REGULATOR X2SON-4; Part_type: ICS\POWER\VOLTAGE REGULATOR; Mfr_name: TEXAS INSTRUMENTS; Mistral Part No: 142018020038-R; Custom_Duty: 15%; Customs_HS_Code: 85423100; Wattage: NA; Project: TI_MAXIE_CPB; Footprint Path: Y:\MIS_DATABASE\Library\ALTIUM_TOOL\PCB_FOOTPRINTS\Altium_Footprint_Lib.PcbLib; Library Path: Y:\MIS_DATABASE\Library\ALTIUM_TOOL\SCHEMATICS_PARTS\MS_MISCPOWER_Library.schlib; MECHANICAL 3D STEP FILE: X2SON4_TLV71318P_40X40_0-4; Chkd/date: MANIRAJA/270218; Crtd /date: ALVY/260218; Datasheet: Y:\MIS_DATABASE\DATASHEETS\ICS\POWER\TLV707X.PDF; Temperature: -40°C+125°C; Weight: 1.5mg; Height: 0.40MM; Footprint Ref: X2SON4_TLV71318P_40X40_0-4; Library Ref: TLV71318PDQNR_X2SON4; Distributor_part_number: 296-36768-1-ND; Distributor_name: DIGIKEY; Package: X2SON-4; Voltage: NA; Tolerance: NA; Mfr_part_number: TLV70718DQNR; PCB Footprint: X2SON4_TLV71318P_40X40_0-4
U59 = TPS6236X_DSBGA16: IC 3A PROCESSOR SUPPLY WITH I2C INTERFACE DSBGA16; Part_type: ICS\POWER\DC-DC CONVERTER; Mfr_name: TEXAS INSTRUMENTS; Mistral Part No: 142017100016-R; Custom_Duty: 15%; Customs_HS_Code: 85423100; Wattage: NA; Project: TI_MAXIE_CPB; MECHANICAL 3D STEP FILE: DSBGA16_19-68_80X80_0-7; Chkd/date: MANIRAJA/261017; Crtd /date: MANIRAJA/261017; Datasheet: Y:\MIS_DATABASE\DATASHEETS\ICS\POWER\TPS6236XX.PDF; Temperature: -40°C+85°C; Weight: NA; Height: 0.63MM; Distributor_part_number: 296-30361-1-ND; Distributor_name: DIGIKEY; Package: DSBGA16; Voltage: NA; Tolerance: NA; Mfr_part_number: TPS62363YZHT; PCB Footprint: DSBGA16_19-68_80X80_0-7; Library Ref: TPS6236X_DSBGA16
U60 = LP5912-1-8DRVT_WSON6: IC 500mA LOW NOISE LOW IQ LDO WSON6; Mistral Part No: 142017090021-R; Mfr_name: TEXAS INSTRUMENTS; Part_type: ICS\POWER\VOLTAGE REGULATOR; Project: TI_MAXIE_CPB; Tolerance: NA; Customs_HS_Code: 85423100; Custom_Duty: 15%; Mfr_part_number: LP5912-1.8DRVT; Voltage: NA; Wattage: NA; Package: WSON6; Distributor_name: DIGIKEY; Distributor_part_number: 296-44156-1-ND; Height: 0.80MM; Weight: 9.7mg; Temperature: -40°C+125°C; Datasheet: Y:\MIS_DATABASE\DATASHEETS\ICS\POWER\LP5912XX.PDF; Crtd /date: MANIRAJA/250917; Chkd/date: MANIRAJA/250917; MECHANICAL 3D STEP FILE: SON6_25-59_85X85_0-8; PCB Footprint: SON6_25-59_85X85_0-8; Library Ref: LP5912-1-8DRVT_WSON6
U61 = TPS62480RNCT_VQFNHR16: IC 2-PHASE STEP DOWN DC-DC CONVERTER VQFN-HR16; Mistral Part No: 142017090012-R; Mfr_name: TEXAS INSTRUMENTS; Part_type: ICS\POWER\DC-DC CONVERTER; Project: TI_MAXIE_CPB; Tolerance: NA; Customs_HS_Code: 85423100; Custom_Duty: 15%; Mfr_part_number: TPS62480RNCT; Voltage: NA; Wattage: NA; Package: VQFN-HR16; Distributor_name: DIGIKEY; Distributor_part_number: 296-43867-1-ND; Height: 1.00MM; Weight: 46mg; Temperature: -40°C+125°C; Datasheet: Y:\MIS_DATABASE\DATASHEETS\ICS\POWER\TPS62480R.PDF; Crtd /date: MANIRAJA/220917; Chkd/date: MANIRAJA/220917; MECHANICAL 3D STEP FILE: VQFNHR16_TPS62480_100X120_1; PCB Footprint: VQFNHR16_TPS62480_100X120_1; Library Ref: TPS62480RNCT_VQFNHR16
U63 = TPS62097RWKT_VQFNHR11: IC 2A SYNCHRONOUS STEP DOWN CONVERTER WITH IDCS CONTROL VQFN-HR11; Part_type: ICS\POWER\CONVERTER; Mfr_name: TEXAS INSTRUMENTS; Mistral Part No: 142017090025-R; Custom_Duty: 15%; Customs_HS_Code: 85423100; Wattage: NA; Project: TI_MAXIE_CPB; PCB Footprint: VQFNHR11_TPS62097_80X80_1; MECHANICAL 3D STEP FILE: VQFNHR11_TPS62097_80X80_1; Chkd/date: MANIRAJA/270917; Crtd /date: MANIRAJA/270917; Datasheet: Y:\MIS_DATABASE\DATASHEETS\ICS\POWER\TPS62097.PDF; Temperature: -40°C+125°C; Weight: NA; Height: 1.00MM; Distributor_part_number: 296-43330-1-ND; Distributor_name: DIGIKEY; Package: VQFN-HR11; Voltage: NA; Tolerance: NA; Mfr_part_number: TPS62097RWKT; Library Ref: TPS62097RWKT_VQFNHR11
U94 = TPS62085RLTR_VSONHR7: IC 3A STEP DOWN CONVERTER WITH SHORT CIRCUIT PROTECTION VSON-HR7; Part_type: ICS\POWER\CONVERTER; Mfr_name: TEXAS INSTRUMENTS; Mistral Part No: 142017100006-R; Custom_Duty: 15%; Customs_HS_Code: 85423100; Wattage: NA; Project: TI_MAXIE_CPB; MECHANICAL 3D STEP FILE: VSONHR7_TPS62085_80X80_1; Chkd/date: MANIRAJA/051017; Crtd /date: MANIRAJA/051017; Datasheet: Y:\MIS_DATABASE\DATASHEETS\ICS\POWER\TPS62085.PDF; Temperature: -40°C+125°C; Weight: NA; Height: 1.00MM; Distributor_part_number: 296-40832-1-ND; Distributor_name: DIGIKEY; Package: VSON-HR7; Voltage: NA; Tolerance: NA; Mfr_part_number: TPS62087RLTR; PCB Footprint: VSONHR7_TPS62085_80X80_1; Library Ref: TPS62085RLTR_VSONHR7